# EAGLE design prototype_v01 (EAGLE 5.07)
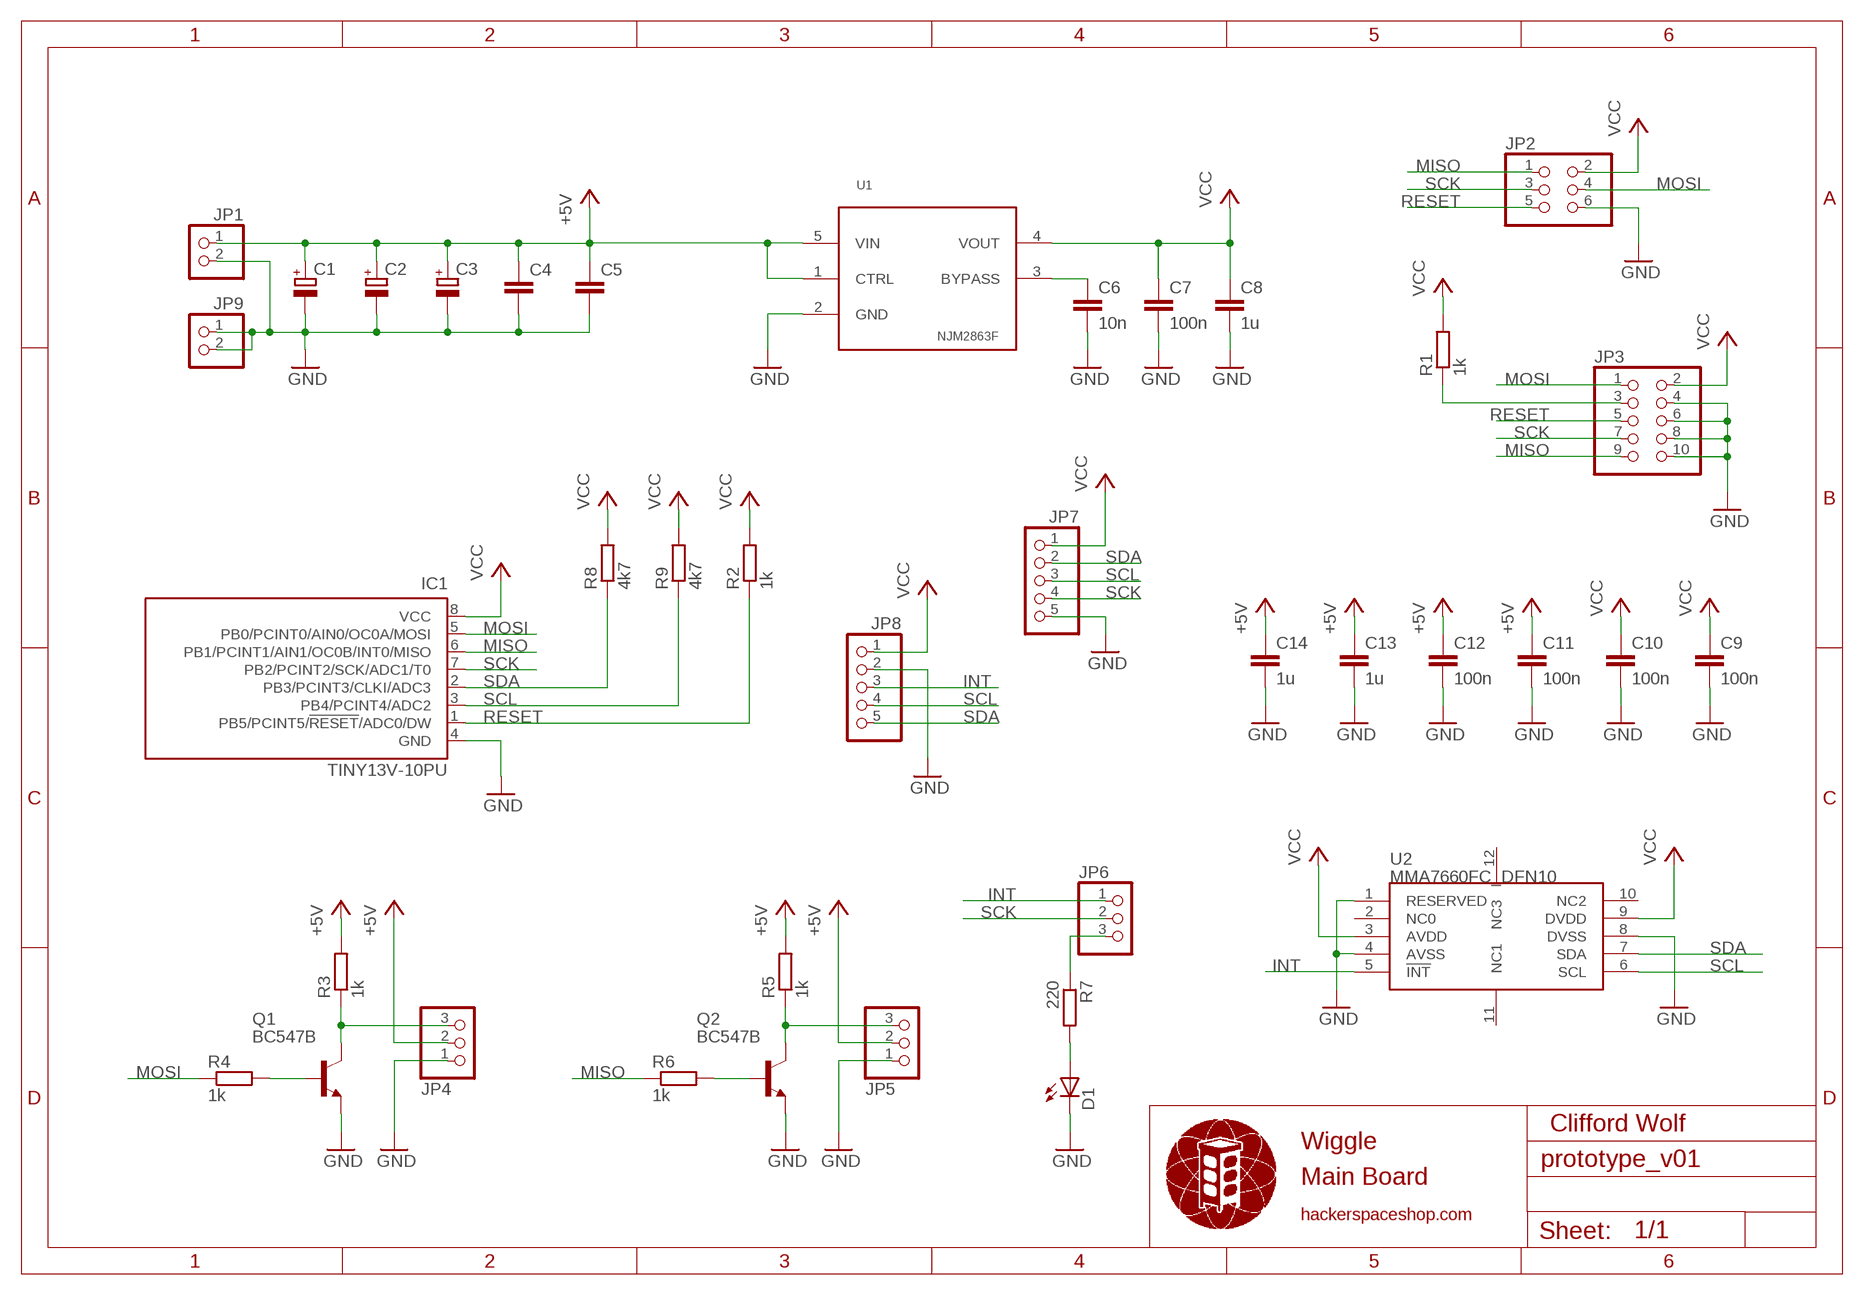
[diagram p0: schematic, sheet 1]

## Parts
C1  CPOLE5-10.5  [E5-10,5]
C2  CPOLE2-5  [E2-5]
C3  CPOLE2-5  [E2-5]
C4  C050-030X075  [C050-030X075]
C5  C050-030X075  [C050-030X075]
C6  10n  C050-030X075  [C050-030X075]
C7  100n  C050-030X075  [C050-030X075]
C8  1u  C050-030X075  [C050-030X075]
C9  100n  C050-030X075  [C050-030X075]
C10  100n  C050-030X075  [C050-030X075]
C11  100n  C050-030X075  [C050-030X075]
C12  100n  C050-030X075  [C050-030X075]
C13  1u  C050-030X075  [C050-030X075]
C14  1u  C050-030X075  [C050-030X075]
D1  LED5MM  [LED5MM]
IC1  TINY13V-10PU  [DIL08]
JP1  PINHD-1X2/90  [1X02/90]
JP2  PINHD-2X3  [2X03]
JP3  TC2050-IDC-NLTC2050-IDC-NL  [TC2050-IDC-NL]
JP4  PINHD-1X3/90  [1X03/90]
JP5  PINHD-1X3/90  [1X03/90]
JP6  PINHD-1X3  [1X03]
JP7  PINHD-1X5  [1X05]
JP8  PINHD-1X5  [1X05]
JP9  PINHD-1X2  [1X02]
Q1  BC547B  [TO92]
Q2  BC547B  [TO92]
R1  1k  R0309/10  [0309/10]
R2  1k  R0309/10  [0309/10]
R3  1k  R0309/10  [0309/10]
R4  1k  R0309/10  [0309/10]
R5  1k  R0309/10  [0309/10]
R6  1k  R0309/10  [0309/10]
R7  220  R0309/10  [0309/10]
R8  4k7  R0309/10  [0309/10]
R9  4k7  R0309/10  [0309/10]
U1  NJM2863F  [SOT23-5L]
U2  MMA7660FC_DFN10  [DFN10]

## Nets
+5V [pwr]: C1.+ C2.+ C3.+ C4.1 C5.1 C11.1 C12.1 C13.1 C14.1 JP1.1 JP4.2 JP5.2 R3.2 R5.2 U1.1(CTRL) U1.5(VIN)
GND [pwr]: C1.- C2.- C3.- C4.2 C5.2 C6.2 C7.2 C8.2 C9.2 C10.2 C11.2 C12.2 C13.2 C14.2 D1.K(C) IC1.4(GND) JP1.2 JP2.6 JP3.4 JP3.6 JP3.8 JP3.10 JP4.1 JP5.1 JP7.5 JP8.2 JP9.1 JP9.2 Q1.1(E) Q2.1(E) U1.2(GND) U2.1(RESERVED) U2.4(AVSS) U2.8(DVSS)
INT: JP6.1 JP8.3 U2.5(!INT)
MISO: IC1.6(PB1/PCINT1/AIN1/OC0B/INT0/MISO) JP2.1 JP3.9 R6.1
MOSI: IC1.5(PB0/PCINT0/AIN0/OC0A/MOSI) JP2.4 JP3.1 R4.1
N$1: JP4.3 Q1.3(C) R3.1
N$2: Q1.2(B) R4.2
N$3: JP3.3 R1.1
N$4: C6.1 U1.3(BYPASS)
N$5: D1.A R7.2
N$6: JP6.3 R7.1
N$7: JP5.3 Q2.3(C) R5.1
N$10: Q2.2(B) R6.2
RESET: IC1.1(PB5/PCINT5/!RESET!/ADC0/DW) JP2.5 JP3.5 R2.1
SCK: IC1.7(PB2/PCINT2/SCK/ADC1/T0) JP2.3 JP3.7 JP6.2 JP7.4
SCL: IC1.3(PB4/PCINT4/ADC2) JP7.3 JP8.4 R9.1 U2.6(SCL)
SDA: IC1.2(PB3/PCINT3/CLKI/ADC3) JP7.2 JP8.5 R8.1 U2.7(SDA)
VCC [pwr]: C7.1 C8.1 C9.1 C10.1 IC1.8(VCC) JP2.2 JP3.2 JP7.1 JP8.1 R1.2 R2.2 R8.2 R9.2 U1.4(VOUT) U2.3(AVDD) U2.9(DVDD)
Unconnected: U2.2(NC0) U2.10(NC2) U2.11(NC1) U2.12(NC3)

## Notes on the sheet
- Clifford Wolf
- Wiggle
- Main Board
- hackerspaceshop.com

## Library data of the parts
C1-C3 = mp_passive:CPOL: POLARIZED CAPACITOR, European symbol
C4-C14 = mp_passive:C: CAPACITOR, European symbol
D1 = mp_diode:LED: LED (5mm)
IC1 = parts:TINY13: 8-bit AVR Microcontroller with 1K Bytes In-System Programmable Flash Source: http://www.atmel.com/dyn/resources/prod_documents/2535S.pdf
JP1 = parts:PINHD-1X2: PIN HEADER
JP2 = parts:PINHD-2X3: PIN HEADER
JP3 = parts:TC2050-IDC-NL: PIN HEADER
JP4-JP6 = mpc_pinhead:PINHD-1X3: PIN HEADER
JP7 JP8 = mpc_pinhead:PINHD-1X5: PIN HEADER
JP9 = mpc_pinhead:PINHD-1X2: PIN HEADER
Q1 Q2 = mp_transistor:BC547B: NPN Transistor
R1-R9 = mp_passive:R: RESISTOR, European symbol
U1 = parts:NJM2863F
U2 = ICs_v54:MMA7660FC

## Net classes
1 pwr: width 0.254 mm

## Board
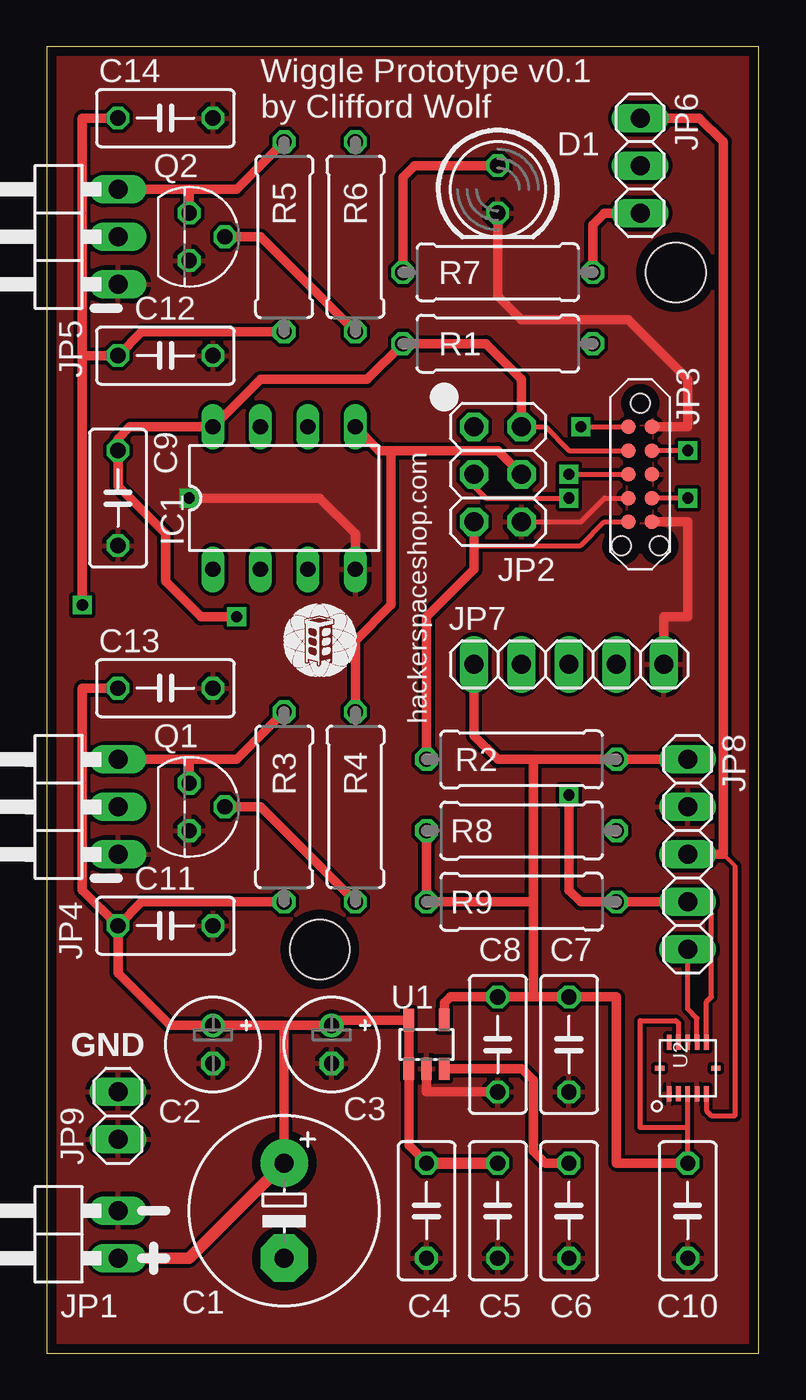
[diagram p1: board, top side]
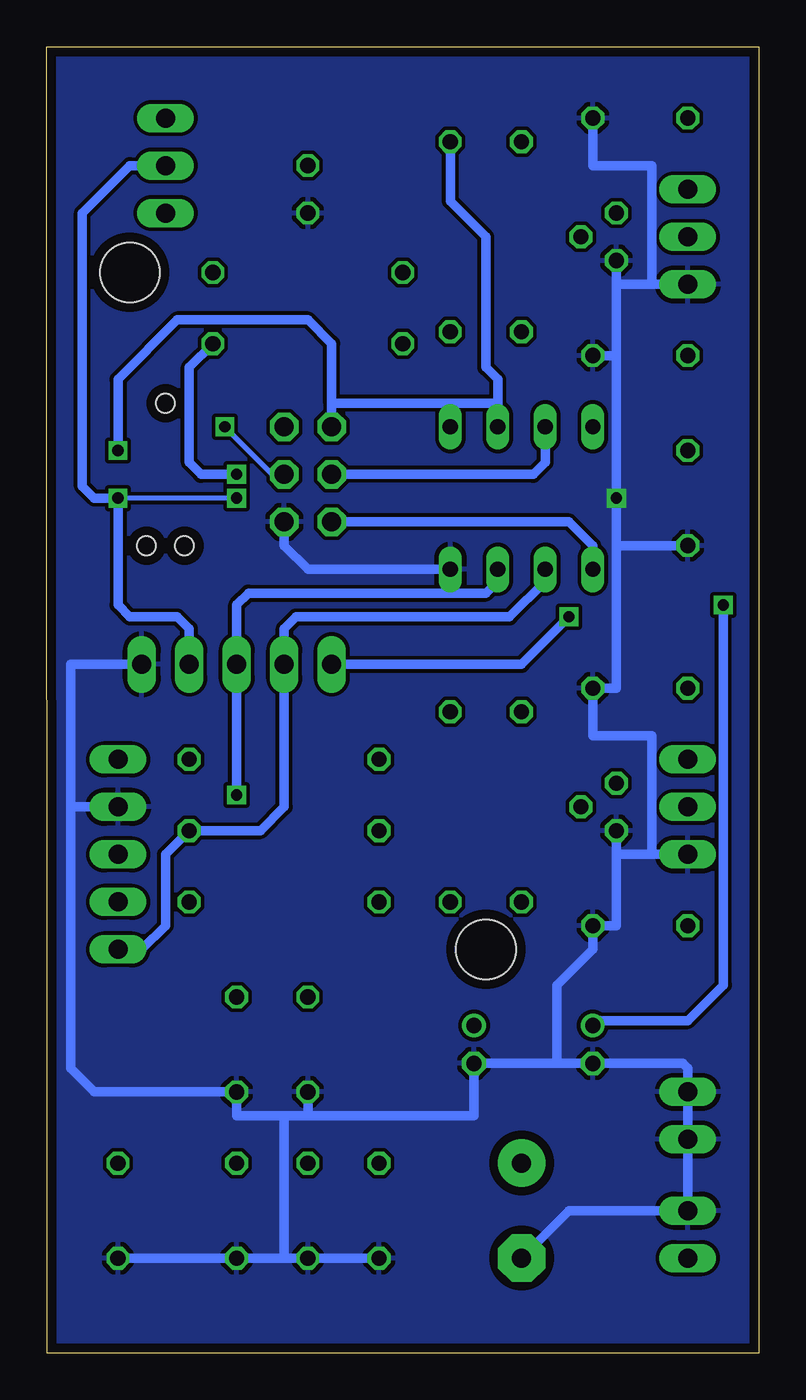
[diagram p2: board, bottom side, seen from below]

Size 38.1 x 69.85 mm. Coordinates in mm from the lower left corner, seen from the top.
Outline: 0,0 38.08,0 38.1,69.85 0,69.85 0,0
Copper layers (1*16): Top 0.035mm / dielectric 1.5mm / Bottom 0.035mm
Design rules "8mils": minimum track width 8mil, minimum drill 0.6mm, track to track 8mil, track to pad 8mil, pad to pad 8mil, via to via 8mil, smd to smd 0mil, copper to edge 20mil, drill to drill 10mil, minimum pad ring 8mil, minimum via ring 8mil, stop-mask expansion 0mil, vias tented up to drill 0mil, thermal gap 10mil
Holes 3.2 mm at 33.66,57.78 14.61,21.59
tRestrict: area 11.3,8.7 to 14.1,11.6; area 11.3,3.7 to 14.1,6.5
bRestrict: area 11.3,8.7 to 14.1,11.6; area 11.3,3.7 to 14.1,6.5

### Footprints (pad centres in the part's own frame; a part is rotated, then mirrored left to right if it is on the bottom)
E5-10,5 = drill 1.016 pad 2.54 round: + -2.54,0 | drill 1.016 pad 2.54 octagon: - 2.54,0
E2-5 = drill 0.813 pad 1.27 round: + -1.016,0 | drill 0.813 pad 1.27 octagon: - 1.016,0
C050-030X075 = drill 0.813 octagon: 1 -2.54,0; 2 2.54,0
LED5MM = drill 0.813 octagon: A -1.27,0; K 1.27,0
DIL08 = drill 0.813 long: 1 -3.81,-3.81; 2 -1.27,-3.81; 3 1.27,-3.81; 4 3.81,-3.81; 5 3.81,3.81; 6 1.27,3.81; 7 -1.27,3.81; 8 -3.81,3.81
1X02/90 = drill 1.016 long: 1 -1.27,-3.81; 2 1.27,-3.81
2X03 = drill 1.016 octagon: 1 -2.54,-1.27; 2 -2.54,1.27; 3 0,-1.27; 4 0,1.27; 5 2.54,-1.27; 6 2.54,1.27
TC2050-IDC-NL = smd 0.787 x 0.787: 1 1.27,-0.635; 2 2.54,-0.635; 3 3.81,-0.635; 4 5.08,-0.635; 5 6.35,-0.635; 6 6.35,0.635; 7 5.08,0.635; 8 3.81,0.635; 9 2.54,0.635; 10 1.27,0.635 | hole 1.016: 0,0; 7.62,1.016; 7.62,-1.016
1X03/90 = drill 1.016 long: 1 -2.54,-3.81; 2 0,-3.81; 3 2.54,-3.81
1X03 = drill 1.016 long: 1 -2.54,0; 2 0,0; 3 2.54,0
1X05 = drill 1.016 long: 1 -5.08,0; 2 -2.54,0; 3 0,0; 4 2.54,0; 5 5.08,0
1X02 = drill 1.016 long: 1 -1.27,0; 2 1.27,0
TO92 = drill 0.813 octagon: 1 1.27,0; 2 0,1.905; 3 -1.27,0
0309/10 = drill 0.813 octagon: 1 -5.08,0; 2 5.08,0
SOT23-5L = smd 0.55 x 1.2: 1 -0.95,-1.3; 2 0,-1.3; 3 0.95,-1.3; 4 0.95,1.3; 5 -0.95,1.3
DFN10 = smd 0.8 x 0.25: 1 -1.375,1; 2 -1.375,0.5; 3 -1.375,0; 4 -1.375,-0.5; 5 -1.375,-1; 6 1.375,-1; 7 1.375,-0.5; 8 1.375,0; 9 1.375,0.5; 10 1.375,1 | smd 0.25 x 0.5: 11 0,-1.5; 12 0,1.5

### Placement (x,y rotation side)
C1  12.7,7.62 270 top
C2  8.89,16.51 270 top
C3  15.24,16.51 270 top
C4  20.32,7.62 270 top
C5  24.13,7.62 270 top
C6  27.94,7.62 270 top
C7  27.94,16.51 270 top
C8  24.13,16.51 270 top
C9  3.81,45.72 270 top
C10  34.29,7.62 270 top
C11  6.35,22.86 0 top
C12  6.35,53.34 0 top
C13  6.35,35.56 0 top
C14  6.35,66.04 0 top
D1  24.13,62.23 270 top
IC1  12.7,45.72 0 top
JP1  0,6.35 90 top
JP2  24.13,46.99 270 top
JP3  31.75,50.8 270 top
JP4  0,29.21 90 top
JP5  0,59.69 90 top
JP6  31.75,63.5 270 top
JP7  27.94,36.83 0 top
JP8  34.29,26.67 270 top
JP9  3.81,12.7 90 top
Q1  7.62,29.21 270 top
Q2  7.62,59.69 270 top
R1  24.13,53.98 180 top
R2  25.4,31.75 0 top
R3  12.7,29.21 270 top
R4  16.51,29.21 270 top
R5  12.7,59.69 270 top
R6  16.51,59.69 270 top
R7  24.13,57.78 180 top
R8  25.4,27.94 180 top
R9  25.4,24.13 180 top
U1  20.32,16.51 0 top
U2  34.29,15.24 90 top
U$1  [METALAB]  14.61,38.1 0 top

### Tracks (layer width: path | path; a pad name or v marks a point on that pad's centre or on a via)
+5V  (via drill 0.6)
  Top 0.508: C4.1 19.37,11.11 U1.1 U1.5 15.52,17.81 C3.+ 12.7,17.53 | C1.+ 12.7,17.14 12.7,17.53 | 12.7,17.53 11.43,17.53 C2.+ 6.6,17.53 3.81,20.32 C11.1 | C11.1 1.91,24.77 1.91,29.21 | 1.91,29.21 1.91,35.56 C13.1 | 1.91,53.34 1.91,59.69 | 1.91,59.69 1.91,66.04 C14.1 | 1.91,53.34 C12.1 5.08,54.61 R5.2 | v1.91,40.01 1.91,53.34 | 1.91,59.69 JP5.2 | 1.91,29.21 JP4.2 | R3.2 5.08,24.13 C11.1
  Top 0.61: JP1.1 7.62,5.08 C1.+ | C4.1 C5.1
  Bottom 0.508: v1.91,40.01 1.91,19.68 3.81,17.78 8.64,17.78 C2.+
GND  (via drill 0.6)
  Top 0.254: JP3.4 29.84,45.72 28.57,44.45 JP2.6
  Top 0.508: U1.2 20.32,13.97 C8.2 | IC1.4 16.51,43.81 14.61,45.72 v7.62,45.72 | D1.K 24.13,56.52 25.4,55.24 31.11,55.24 34.29,52.07 34.29,49.53 JP3.10 | JP3.6 34.29,44.45 34.29,39.37 33.02,39.37 JP7.5
  Bottom 0.508: 5.71,57.15 JP5.1 | 7.62,57.15 5.71,57.15 | 7.62,57.15 Q2.1 | 7.62,53.34 C12.2 | 7.62,53.34 7.62,57.15 | C14.2 8.89,63.5 5.71,63.5 5.71,57.15 | 5.71,26.67 JP4.1 | 7.62,26.67 5.71,26.67 | 7.62,26.67 Q1.1 | 7.62,26.67 7.62,22.86 C11.2 8.89,21.59 10.79,19.68 10.79,15.49 | 5.71,26.67 5.71,33.02 8.89,33.02 C13.2 7.62,35.56 7.62,43.18 | 7.62,43.18 v7.62,45.72 7.62,53.34 | 7.62,43.18 C9.2 | JP2.6 25.4,43.18 24.13,41.91 IC1.4 | 10.79,15.49 C2.- 4.06,15.49 3.81,15.24 JP9.2 JP9.1 JP1.2 10.16,7.62 C1.- | 10.79,15.49 C3.- 15.24,12.7 24.13,12.7 | 24.13,12.7 C8.2 | C10.2 C6.2 25.4,5.08 | 25.4,5.08 C5.2 C4.2 | 24.13,12.7 25.4,12.7 | 25.4,12.7 27.94,12.7 C7.2 35.56,13.97 36.83,15.24 36.83,29.21 | 25.4,12.7 25.4,5.08 | 36.83,29.21 JP8.2 | JP7.5 36.83,36.83 36.83,29.21
  pour Bottom: 0,0 38.1,0 38.1,69.85 0,69.85
  pour Top: 0,69.85 0,0 38.1,0 38.1,69.85
INT
  Top 0.203: 36.83,26.04 36.2,26.67
  Top 0.254: U2.5 35.29,12.97 35.56,12.7 36.83,12.7 36.83,26.04
  Top 0.508: JP6.1 34.92,66.04 36.2,64.77 36.2,26.67 JP8.3
MISO  (via drill 0.6)
  Top 0.254: v34.29,48.26 JP3.9
  Bottom 0.508: R6.1 16.51,61.59 14.61,59.69 14.61,52.7 13.97,52.07 13.97,50.8 | IC1.6 13.97,50.8 | 13.97,50.8 22.86,50.8 | 22.86,50.8 JP2.1 | v34.29,48.26 34.29,52.07 31.11,55.24 24.13,55.24 22.86,53.98 22.86,50.8
MOSI  (via drill 0.6)
  Top 0.254: v28.57,49.53 JP3.1
  Top 0.508: R4.1 16.51,38.1 18.41,40.01 18.41,48.26 | JP2.4 24.13,48.26 18.41,48.26 | 18.41,48.26 17.78,48.26 IC1.5
  Bottom 0.254: JP2.4 26.04,46.99 v28.57,49.53
N$1
  Top 0.508: JP4.3 7.62,31.75 | 7.62,31.75 10.16,31.75 R3.1 | 7.62,31.75 Q1.3
N$2
  Top 0.508: Q1.2 11.43,29.21 R4.2
N$3  (via drill 0.6)
  Top 0.254: v27.94,46.99 JP3.3
  Bottom 0.508: v27.94,46.99 29.84,46.99 30.48,47.62 30.48,52.7 R1.1
N$4
  Top 0.508: U1.3 25.43,15.21 26.04,14.61 26.04,10.79 26.67,10.16 C6.1
N$5
  Top 0.508: R7.2 19.05,62.87 19.68,63.5 D1.A
N$6
  Top 0.508: R7.1 29.21,60.33 29.84,60.96 JP6.3
N$7
  Top 0.508: JP5.3 7.62,62.23 | 7.62,62.23 10.16,62.23 R5.1 | 7.62,62.23 Q2.3
N$10
  Top 0.508: Q2.2 11.43,59.69 R6.2
RESET
  Top 0.254: JP3.5 29.84,44.45 28.57,43.18 22.86,43.18
  Top 0.508: R2.1 20.32,39.37 22.86,41.91 22.86,43.18 JP2.5
  Bottom 0.508: IC1.1 8.89,43.18 10.16,44.45 JP2.5
SCK  (via drill 0.6)
  Top 0.254: JP2.3 22.86,46.35 23.5,45.72 v27.94,45.72 | v34.29,45.72 JP3.7
  Bottom 0.254: v27.94,45.72 v34.29,45.72
  Bottom 0.508: IC1.7 11.43,47.62 12.06,46.99 JP2.3 | JP6.2 33.66,63.5 36.2,60.96 36.2,46.35 35.56,45.72 v34.29,45.72 34.29,40.01 33.66,39.37 31.11,39.37 30.48,38.73 JP7.4
SCL  (via drill 0.6)
  Top 0.254: U2.6 35.29,18.78 35.56,19.05 35.56,23.5 34.92,24.13 JP8.4
  Top 0.508: JP8.4 R9.1 28.57,24.13 27.94,24.77 v27.94,29.84
  Bottom 0.508: IC1.3 13.97,41.27 14.61,40.64 27.3,40.64 27.94,40.01 JP7.3 v27.94,29.84
SDA
  Top 0.254: U2.7 34.79,17.91 34.29,18.41 JP8.5
  Bottom 0.508: JP8.5 33.02,21.59 31.75,22.86 31.75,26.67 R8.1 26.67,27.94 25.4,29.21 JP7.2 25.4,38.73 24.77,39.37 13.34,39.37 11.43,41.27 IC1.2
VCC  (via drill 0.6)
  Top 0.254: C10.1 34.29,12.06 | 34.29,12.06 U2.3 | U2.9 33.79,17.64 33.66,17.78 31.75,17.78 31.75,12.06 34.29,12.06 | JP2.2 26.67,49.53 27.94,48.26 JP3.2
  Top 0.508: U1.4 21.27,18.73 21.59,19.05 C8.1 26.04,19.05 | 26.04,19.05 C7.1 30.48,19.05 30.48,10.16 C10.1 | R8.2 R9.2 26.04,24.13 | 26.04,19.05 26.04,24.13 | JP7.1 22.86,33.02 24.13,31.75 26.04,31.75 | 26.04,31.75 R2.2 JP8.1 | 26.04,24.13 26.04,31.75 | JP2.2 25.4,52.07 23.5,53.98 R1.2 17.14,52.07 11.43,52.07 IC1.8 4.45,49.53 3.81,48.9 C9.1 3.81,46.35 6.35,43.81 6.35,41.27 8.26,39.37 v10.16,39.37
  Bottom 0.508: JP7.1 12.7,36.83 v10.16,39.37

### Text on the board
tPlace: Wiggle Prototype v0.1 | by Clifford Wolf | hackerspaceshop.com | GND